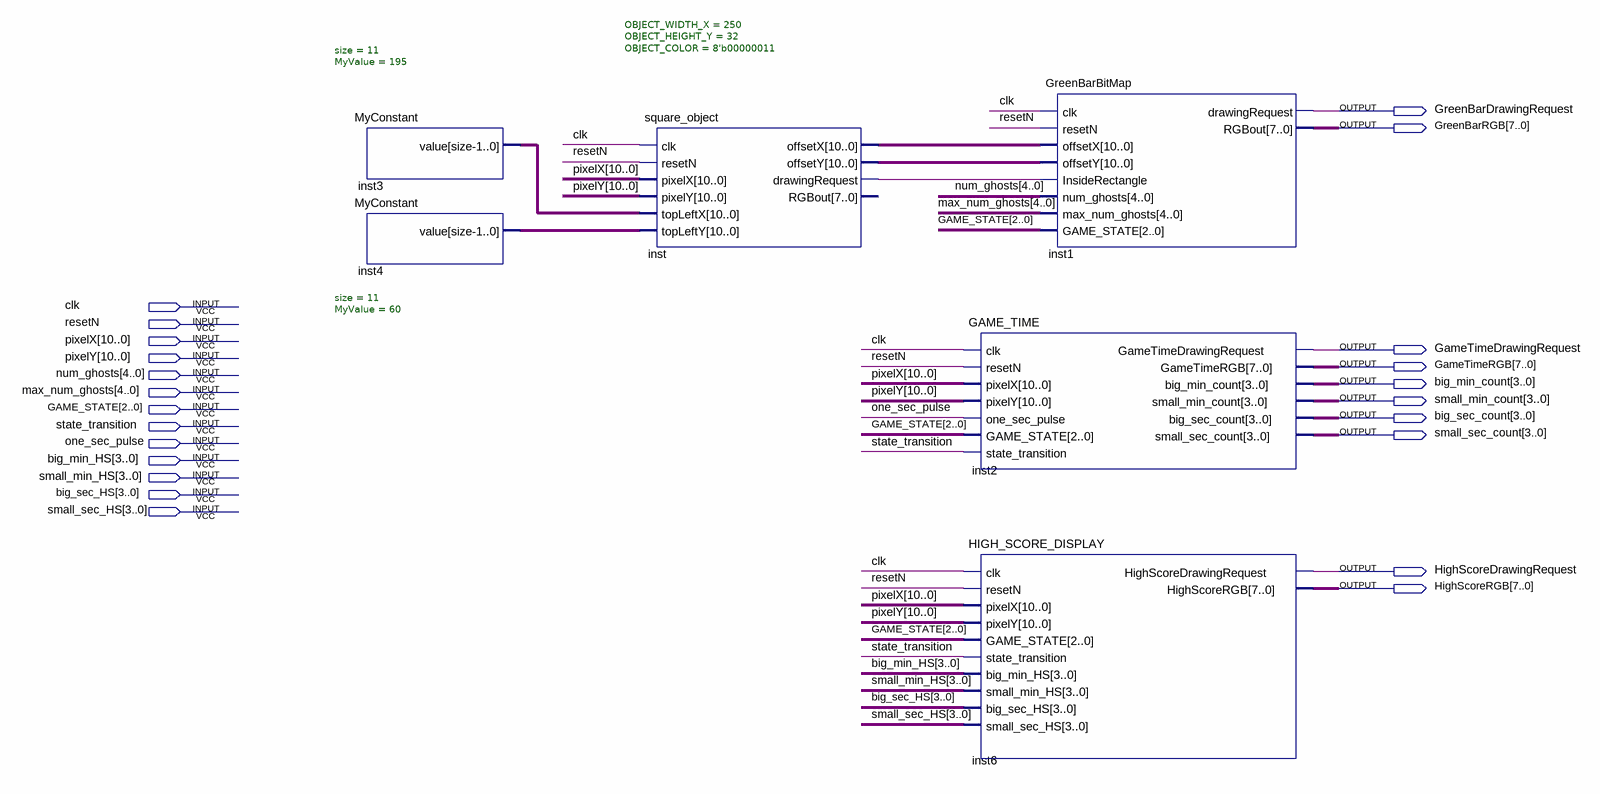
[diagram p0: schematic sheet]
// Quartus schematic GAME_STATS.bdf as structural Verilog: 6 symbols, 23 pins
module GAME_STATS (
  input  clk,
  input  resetN,
  input  [10:0] pixelX,
  input  [10:0] pixelY,
  input  [4:0] num_ghosts,
  input  [4:0] max_num_ghosts,
  input  [2:0] GAME_STATE,
  input  state_transition,
  input  one_sec_pulse,
  input  [3:0] big_min_HS,
  input  [3:0] small_min_HS,
  input  [3:0] big_sec_HS,
  input  [3:0] small_sec_HS,
  output GreenBarDrawingRequest,
  output [7:0] GreenBarRGB,
  output GameTimeDrawingRequest,
  output [7:0] GameTimeRGB,
  output [3:0] big_min_count,
  output [3:0] small_min_count,
  output [3:0] big_sec_count,
  output [3:0] small_sec_count,
  output HighScoreDrawingRequest,
  output [7:0] HighScoreRGB
);

  wire inst_drawingrequest;
  wire [10:0] inst3_value, inst4_value, inst_offsetx, inst_offsety;

  MyConstant #(.size(11), .MyValue(195)) inst3 (.value(inst3_value));
  MyConstant #(.size(11), .MyValue(60)) inst4 (.value(inst4_value));
  square_object #(.OBJECT_WIDTH_X(250), .OBJECT_HEIGHT_Y(32), .OBJECT_COLOR(8'b00000011)) inst (
    .clk(clk), .resetN(resetN), .pixelX(pixelX), .pixelY(pixelY), .topLeftX(inst3_value),
    .topLeftY(inst4_value), .offsetX(inst_offsetx), .offsetY(inst_offsety),
    .drawingRequest(inst_drawingrequest));  // open: RGBout
  GAME_TIME inst2 (
    .clk(clk), .resetN(resetN), .pixelX(pixelX), .pixelY(pixelY), .one_sec_pulse(one_sec_pulse),
    .GAME_STATE(GAME_STATE), .state_transition(state_transition),
    .GameTimeDrawingRequest(GameTimeDrawingRequest), .GameTimeRGB(GameTimeRGB),
    .big_min_count(big_min_count), .small_min_count(small_min_count), .big_sec_count(big_sec_count),
    .small_sec_count(small_sec_count));
  HIGH_SCORE_DISPLAY inst6 (
    .clk(clk), .resetN(resetN), .pixelX(pixelX), .pixelY(pixelY), .GAME_STATE(GAME_STATE),
    .state_transition(state_transition), .big_min_HS(big_min_HS), .small_min_HS(small_min_HS),
    .big_sec_HS(big_sec_HS), .small_sec_HS(small_sec_HS), .HighScoreDrawingRequest(HighScoreDrawingRequest),
    .HighScoreRGB(HighScoreRGB));
  GreenBarBitMap inst1 (
    .clk(clk), .resetN(resetN), .offsetX(inst_offsetx), .offsetY(inst_offsety),
    .InsideRectangle(inst_drawingrequest), .num_ghosts(num_ghosts), .max_num_ghosts(max_num_ghosts),
    .GAME_STATE(GAME_STATE), .drawingRequest(GreenBarDrawingRequest), .RGBout(GreenBarRGB));
endmodule
